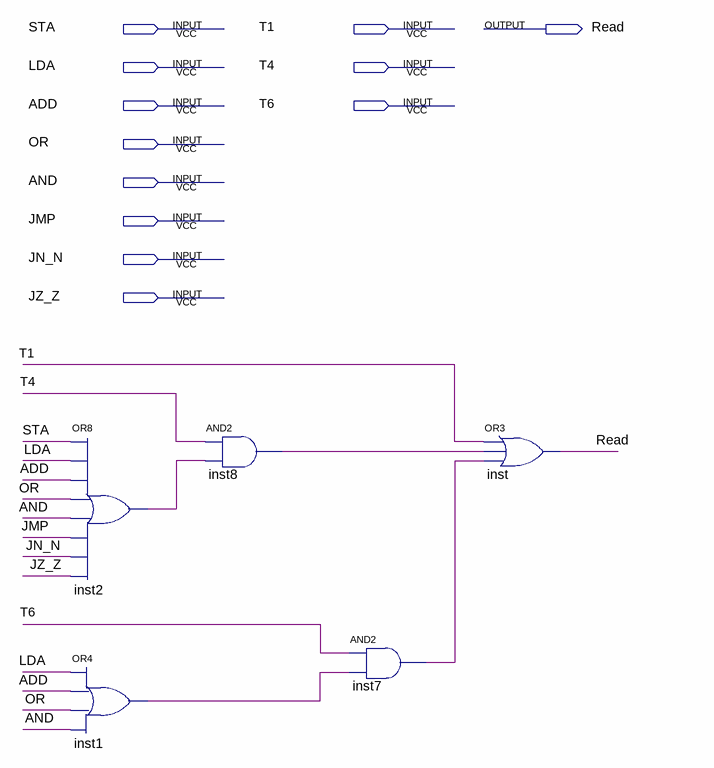
[diagram p0: schematic sheet]
// Quartus schematic Read.bdf as structural Verilog: 5 symbols, 12 pins
module Read (
  input  STA,
  input  T1,
  input  LDA,
  input  T4,
  input  ADD,
  input  T6,
  input  OR,
  input  AND,
  input  JMP,
  input  JN_N,
  input  JZ_Z,
  output Read
);

  wire inst1_out, inst2_out, inst7_out, inst8_out;

  or inst2 (inst2_out, STA, LDA, ADD, OR, AND, JMP, JN_N, JZ_Z);
  or inst1 (inst1_out, LDA, ADD, OR, AND);
  and inst8 (inst8_out, T4, inst2_out);
  and inst7 (inst7_out, T6, inst1_out);
  or inst (Read, T1, inst8_out, inst7_out);
endmodule
